# EAGLE design ChargingBoard (EAGLE 5.10)
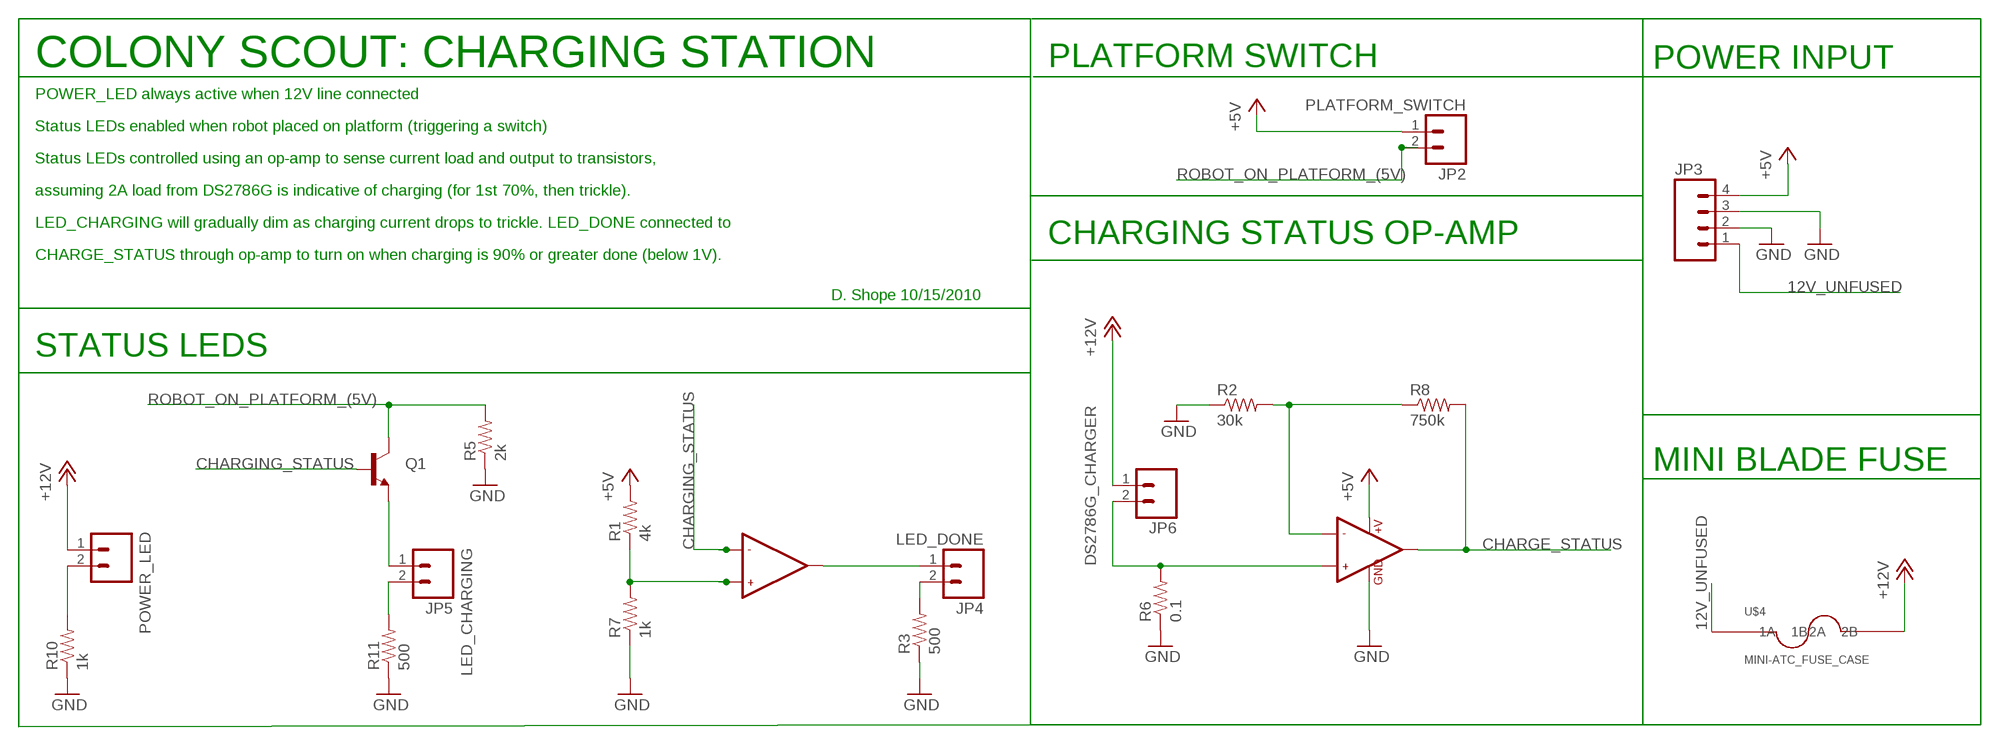
[diagram p0: schematic, sheet 1]

## Parts
JP2  PLATFORM_SWITCH  M02PTH  [1X02]
JP3  M04PTH  [1X04]
JP4  LED_DONE  M02PTH  [1X02]
JP5  LED_CHARGING  M02PTH  [1X02]
JP6  DS2786G_CHARGER  M02PTH  [1X02]
POWER_LED  M02PTH  [1X02]
Q1  TRANSISTOR_NPN  [SOT223]
R1  4k  RESISTOR1206  [1206]
R2  30k  RESISTOR1206  [1206]
R3  500  RESISTOR1206  [1206]
R5  2k  RESISTOR1206  [1206]
R6  0.1  RESISTOR2010  [R2010]
R7  1k  RESISTOR1206  [1206]
R8  750k  RESISTOR1206  [1206]
R10  1k  RESISTOR1206  [1206]
R11  500  RESISTOR1206  [1206]
U$2  LMV358  [SO08]
U$4  MINI-ATC_FUSE_CASE  [3544-2]

## Nets
12V_UNFUSED: JP3.1 U$4.1A
+5V: JP2.1 JP3.4 R1.2 U$2.8(+V)
+12V: JP6.1 POWER_LED.1 U$4.2B
CHARGE_STATUS: R8.2 U$2.1(OUT1)
CHARGING_STATUS: Q1.1(B) U$2.6(-IN2)
GND: JP3.2 JP3.3 R2.1 R3.1 R5.1 R6.1 R7.1 R10.1 R11.1 U$2.4(GND)
LED_DONE: JP4.1 U$2.7(OUT2)
N$1: POWER_LED.2 R10.2
N$3: R2.2 R8.1 U$2.2(-IN1)
N$4: JP5.1 Q1.3(E)
N$6: R1.1 R7.2 U$2.5(+IN2)
N$7: JP6.2 R6.2 U$2.3(+IN1)
N$8: JP5.2 R11.2
N$9: JP4.2 R3.2
ROBOT_ON_PLATFORM_(5V): JP2.2 Q1.2(C) R5.2
Unconnected: U$4.1B U$4.2A

## Notes on the sheet
- COLONY SCOUT: CHARGING STATION | PLATFORM SWITCH | POWER INPUT
- POWER_LED always active when 12V line connected
- Status LEDs enabled when robot placed on platform (triggering a switch)
- Status LEDs controlled using an op-amp to sense current load and output to transistors,
- assuming 2A load from DS2786G is indicative of charging (for 1st 70%, then trickle).
- LED_CHARGING will gradually dim as charging current drops to trickle. LED_DONE connected to
- CHARGING STATUS OP-AMP
- CHARGE_STATUS through op-amp to turn on when charging is 90% or greater done (below 1V).
- D. Shope 10/15/2010
- STATUS LEDS
- MINI BLADE FUSE

## Library data of the parts
JP2 JP4-JP6 POWER_LED = SparkFun:M02: Header 2 Standard 2-pin 0.1" header. Use with straight break away headers (SKU : PRT-00116), right angle break away headers (PRT-00553), swiss pins (PRT-00743), machine pins (PRT-00117), and female headers (PRT-00115). Molex polarized connector foot print use with SKU : PRT-08233 with associated crimp pins and housings.
JP3 = SparkFun:M04: Header 4 Standard 4-pin 0.1" header. Use with straight break away headers (SKU : PRT-00116), right angle break away headers (PRT-00553), swiss pins (PRT-00743), machine pins (PRT-00117), and female headers (PRT-00115). Molex polarized connector foot print use with SKU : PRT-08231 with associated crimp pins and housings.
Q1 = SparkFun:TRANSISTOR_NPN: Transistor NPN BJT configuration in SOT23 package. MMBT2222 is the common NPN we use. Double check BCE configuration again layout.
R1-R3 R5-R8 R10 R11 = SparkFun:RESISTOR: Resistor Basic schematic elements and footprints for 0603, 1206, and PTH 1/10th watt (small) resistors.
U$2 = SparkFun:LMV358
U$4 = erhart:MINI-ATC_FUSE_CASE

## Board
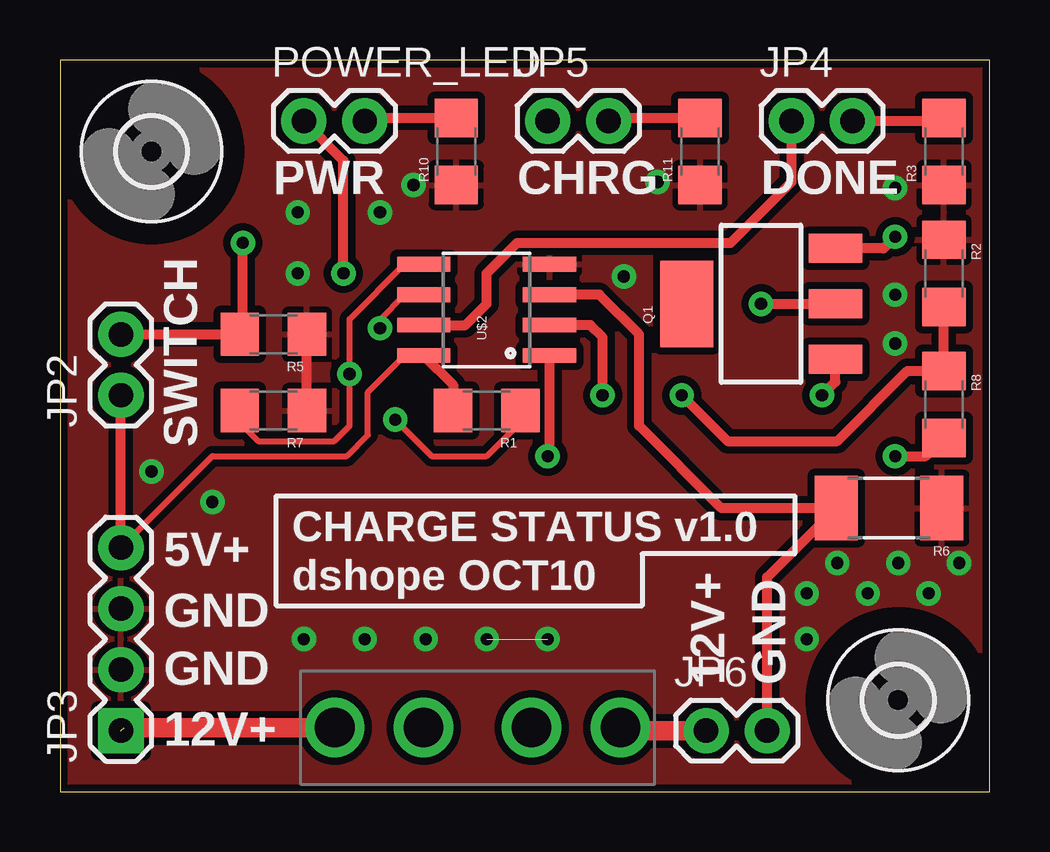
[diagram p1: board, top side]
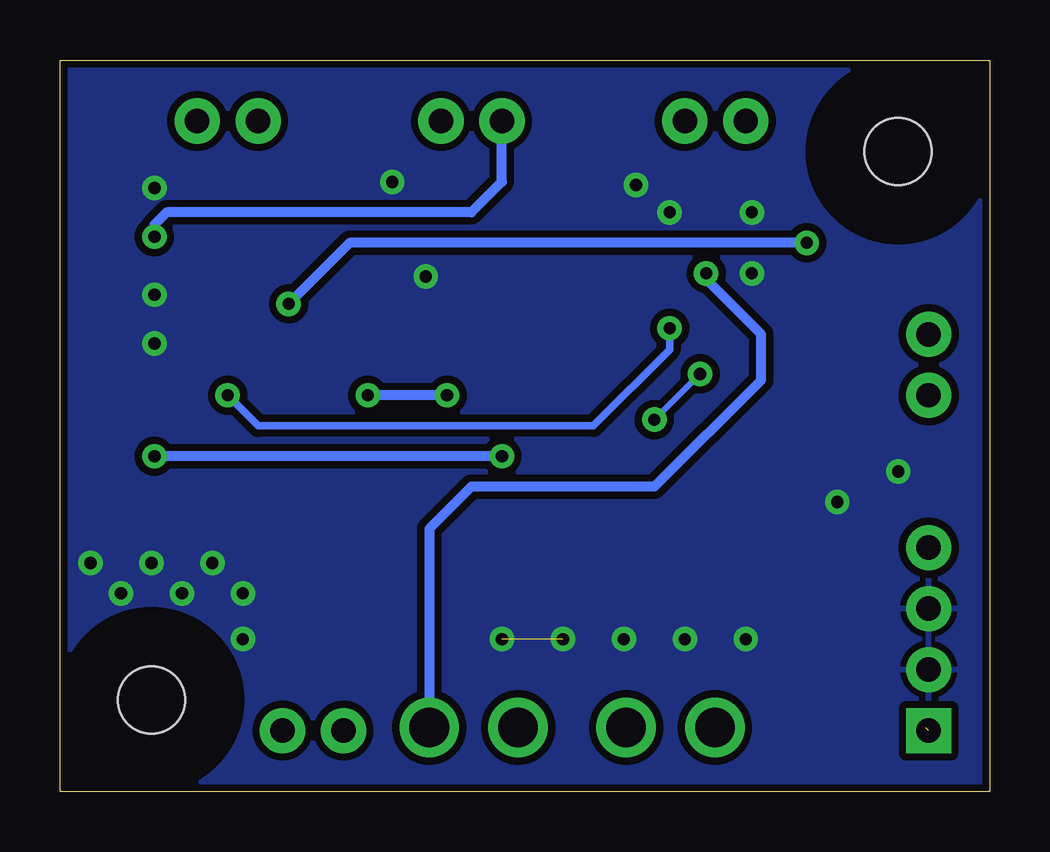
[diagram p2: board, bottom side, seen from below]

Size 38.73 x 30.48 mm. Coordinates in mm from the lower left corner, seen from the top.
Outline: 0,0 38.73,0 38.73,30.48 0,30.48 0,0
Copper layers (1*16): Top 0.035mm / dielectric 1.5mm / Bottom 0.035mm
Design rules "SparkFun": minimum track width 8mil, minimum drill 20mil, track to track 8mil, track to pad 8mil, pad to pad 8mil, via to via 8mil, smd to smd 8mil, copper to edge 10mil, drill to drill 8mil, minimum pad ring 12mil, minimum via ring 10mil, stop-mask expansion 4mil, vias tented up to drill 25mil, thermal gap 10mil

### Footprints (pad centres in the part's own frame; a part is rotated, then mirrored left to right if it is on the bottom)
1X02 = drill 1.016 pad 1.88 round: 1 0,0; 2 2.54,0
1X04 = drill 1.016 pad 1.88 square: 1 0,0 | drill 1.016 pad 1.88 round: 2 2.54,0; 3 5.08,0; 4 7.62,0
SOT223 = smd 1.219 x 2.235: 1 -2.311,-3.099; 2 0,-3.099; 3 2.311,-3.099 | smd 3.6 x 2.2: 4 0,3.099
1206 = smd 1.6 x 1.8: 1 -1.4,0; 2 1.4,0
R2010 = smd 1.8 x 2.7: 1 -2.2,0; 2 2.2,0
2,8 = hole 2.8: 0,0
SO08 = smd 0.61 x 2.21: 1 -1.905,-2.616; 2 -0.635,-2.616; 3 0.635,-2.616; 4 1.905,-2.616; 5 1.905,2.616; 6 0.635,2.616; 7 -0.635,2.616; 8 -1.905,2.616
3544-2 = drill 1.65 round: 1A -5.95,0; 1B -2.25,0; 2A 2.25,0; 2B 5.95,0

### Placement (x,y rotation side)
JP2  2.54,16.51 90 top
JP3  2.54,2.54 90 top
JP4  30.48,27.94 0 top
JP5  20.32,27.94 0 top
JP6  26.92,2.54 0 top
POWER_LED  10.16,27.94 0 top
Q1  29.21,20.32 90 top
R1  17.78,15.88 180 top
R2  36.83,21.59 270 top
R3  36.83,26.67 90 top
R5  8.89,19.05 180 top
R6  34.54,11.81 180 top
R7  8.89,15.88 180 top
R8  36.83,16.13 270 top
R10  16.51,26.67 90 top
R11  26.67,26.67 90 top
U$1  [2,8]  3.81,26.67 0 top
U$2  17.78,20.07 90 top
U$3  [2,8]  34.92,3.81 0 top
U$4  17.4,2.67 0 top

### Tracks (layer width: path | path; a pad name or v marks a point on that pad's centre or on a via)
12V_UNFUSED  (1 unrouted)
  Top 0.813: 2.67,2.67 U$4.1A
+5V
  Top 0.254: U$2.8 14.35,18.16 12.83,16.64 12.83,14.86 11.94,13.97 6.35,13.97 JP3.4
  Top 0.406: JP3.4 JP2.1 | U$2.8 16.38,16.95 R1.2
+12V  (via drill 0.51)
  Top 0.406: POWER_LED.1 11.81,26.29 v11.81,21.59
  Top 0.813: JP6.1 23.48,2.54 U$4.2B
  Bottom 0.406: v11.81,21.59 11.81,21.34 9.53,19.05 9.53,17.14 13.97,12.7 21.59,12.7 23.35,10.94 U$4.2B
CHARGE_STATUS  (via drill 0.51)
  Top 0.406: U$2.1 20.4,14.05 v20.32,13.97 | v34.8,13.97 36.07,13.97 R8.2
  Bottom 0.406: v20.32,13.97 v34.8,13.97
CHARGING_STATUS  (via drill 0.51)
  Top 0.254: v13.34,19.3 13.34,19.68 14.35,20.7 U$2.6
  Top 0.406: v31.75,16.51 32.31,17.07 Q1.1
  Bottom 0.305: v13.34,19.3 13.34,18.41 16.51,15.24 30.48,15.24 v31.75,16.51
GND  (via drill 0.51)  (1 unrouted)
  Top 0.406: R5.1 10.03,19.05 | R5.1 10.16,19.18 | R7.1 R5.1
  other vias: 24.89,25.4 23.5,21.46 34.8,20.7 34.8,18.67 34.8,25.15 9.91,21.59 9.91,24.13 6.35,12.06 13.34,24.13 3.81,13.34 32.38,9.53 34.92,9.53 37.47,9.53 36.2,8.26 31.11,8.26 33.66,8.26 31.11,6.35 14.73,25.27 10.16,6.35 12.7,6.35 15.24,6.35 17.78,6.35 20.32,6.35
  pour Bottom (isolate 0.305): 0,30.48 0,0 38.73,0 38.73,30.48
  pour Top (isolate 0.305): 0,31.11 0,0 38.73,-0.13 38.73,30.99
LED_DONE
  Top 0.406: U$2.7 16.89,19.43 17.78,20.32 17.78,21.59 19.05,22.86 27.94,22.86 30.48,25.4 JP4.1
N$1
  Top 0.406: R10.2 12.83,28.07 POWER_LED.2
N$3  (via drill 0.51)
  Top 0.406: R2.2 R8.1 35.31,17.53 32.38,14.61 27.81,14.61 v25.91,16.51 | U$2.2 22.1,19.43 22.61,18.92 v22.61,16.51
  Bottom 0.406: v22.61,16.51 v25.91,16.51
N$4  (via drill 0.51)
  Top 0.406: Q1.3 34.31,22.63 v34.8,23.11
  Bottom 0.406: v34.8,23.11 34.8,23.62 34.29,24.13 21.59,24.13 20.32,25.4 JP5.1
N$6  (via drill 0.51)
  Top 0.254: 7.75,16.38 7.62,16.38 R7.2 7.49,15.37 8.26,14.61 11.43,14.61 12.06,15.24 v12.06,17.4 12.06,19.68 14.35,21.97 U$2.5 | R1.1 19.18,15.37 17.78,13.97 15.49,13.97 v13.97,15.49
  Top 0.406: R1.1 19.18,15.5
  Bottom 0.254: v12.06,17.4 v13.97,15.49
N$7
  Top 0.406: JP6.2 29.46,8.93 R6.2 27.56,11.81 24.13,15.24 24.13,19.05 22.48,20.7 U$2.3
N$8
  Top 0.406: R11.2 22.99,28.07 JP5.2
N$9
  Top 0.406: JP4.2 36.7,27.94 R3.2
ROBOT_ON_PLATFORM_(5V)  (via drill 0.51)
  Top 0.406: v7.62,22.86 7.62,19.18 R5.2 JP2.2 | v29.21,20.32 Q1.2
  Bottom 0.406: v29.21,20.32 26.67,22.86 v7.62,22.86

### Text on the board
tPlace: PWR | CHRG | DONE | SWITCH | CHARGE STATUS v1.0 | 5V+ | dshope OCT10 | GND | GND | 12V+ | GND | 12V+